# EAGLE schematic fretscanner-untangle (EAGLE 6.6.0)
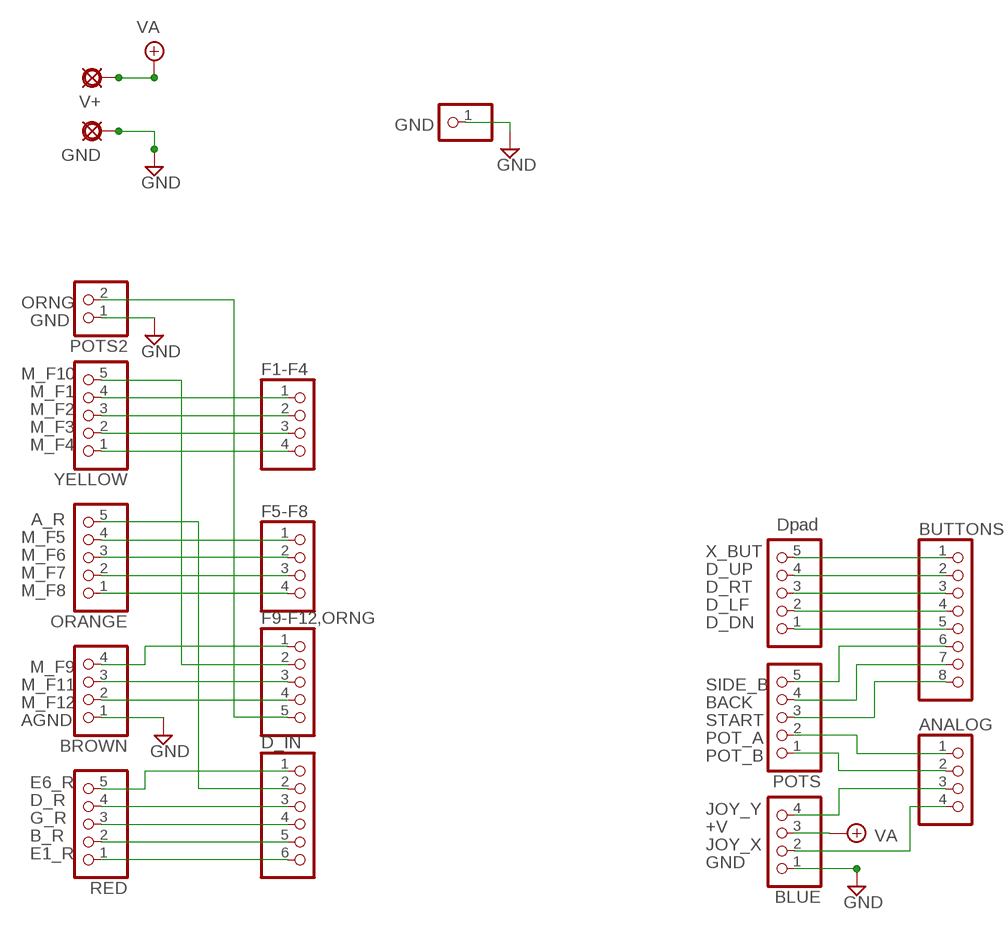
[diagram p0: schematic, sheet 1]

## Parts
ANALOG  PINHD-1X4  [1X04]
BLUE  PINHD-1X4  [1X04]
BROWN  PINHD-1X4  [1X04]
BUTTONS  PINHD-1X8  [1X08]
D_IN  PINHD-1X6  [1X06]
DPAD  PINHD-1X5  [1X05]
DPAD2  PINHD-1X1  [1X01]
F1-F4  PINHD-1X4  [1X04]
F5-F8  PINHD-1X4  [1X04]
F9-F12,ORNG  PINHD-1X5  [1X05]
GND  PADL  [LONG]
ORANGE  PINHD-1X5  [1X05]
POTS  PINHD-1X5  [1X05]
POTS2  PINHD-1X2  [1X02]
RED  PINHD-1X5  [1X05]
V+  PADL  [LONG]
YELLOW  PINHD-1X5  [1X05]

## Nets
BACK: BUTTONS.7 POTS.4
D0: D_IN.1 RED.5
GND: BLUE.1 BROWN.1 DPAD2.1 GND.1(PAD) POTS2.1
JOY_X: ANALOG.4 BLUE.2
JOY_Y: ANALOG.3 BLUE.4
N$1: F1-F4.1 YELLOW.4
N$2: F1-F4.2 YELLOW.3
N$3: F1-F4.3 YELLOW.2
N$4: F1-F4.4 YELLOW.1
N$5: F5-F8.1 ORANGE.4
N$6: F5-F8.2 ORANGE.3
N$7: F5-F8.3 ORANGE.2
N$8: F5-F8.4 ORANGE.1
N$9: BROWN.4 F9-F12,ORNG.1
N$10: F9-F12,ORNG.2 YELLOW.5
N$11: D_IN.3 RED.4
N$12: D_IN.4 RED.3
N$13: D_IN.2 ORANGE.5
N$14: BROWN.3 F9-F12,ORNG.3
N$15: BROWN.2 F9-F12,ORNG.4
N$16: F9-F12,ORNG.5 POTS2.2
N$17: D_IN.5 RED.2
N$18: D_IN.6 RED.1
N$19: BUTTONS.1 DPAD.5
N$20: BUTTONS.2 DPAD.4
N$21: BUTTONS.3 DPAD.3
N$22: BUTTONS.4 DPAD.2
N$23: BUTTONS.5 DPAD.1
POT_A: ANALOG.1 POTS.2
POT_B: ANALOG.2 POTS.1
SIDE_B: BUTTONS.6 POTS.5
START: BUTTONS.8 POTS.3
VA: BLUE.3 V+.1(PAD)

## Notes on the sheet
- GND
- ORNG
- GND
- M_F10
- M_F1
- M_F2
- M_F3
- M_F4
- A_R
- M_F5 | Dpad
- M_F6
- X_BUT
- M_F7
- D_UP
- M_F8
- D_RT
- D_LF
- D_DN
- M_F9
- M_F11 | SIDE_B
- M_F12 | BACK
- AGND | START
- POT_A
- POT_B
- E6_R
- D_R
- JOY_Y
- G_R
- +V
- B_R
- JOY_X
- E1_R
- GND

## Library data of the parts
ANALOG BLUE BROWN F1-F4 F5-F8 = pinhead:PINHD-1X4: PIN HEADER
BUTTONS = pinhead:PINHD-1X8: PIN HEADER
D_IN = pinhead:PINHD-1X6: PIN HEADER
DPAD F9-F12,ORNG ORANGE POTS RED YELLOW = pinhead:PINHD-1X5: PIN HEADER
DPAD2 = pinhead:PINHD-1X1: PIN HEADER
GND V+ = gm-supply:PAD: PAD use this package for pads with any purpose, including input, output, send or return various pad shapes: round, square, octogonal, long, and long offset
POTS2 = pinhead:PINHD-1X2: PIN HEADER